# Altium project Sayma_RTM.PrjPcb (part 1 of 11)
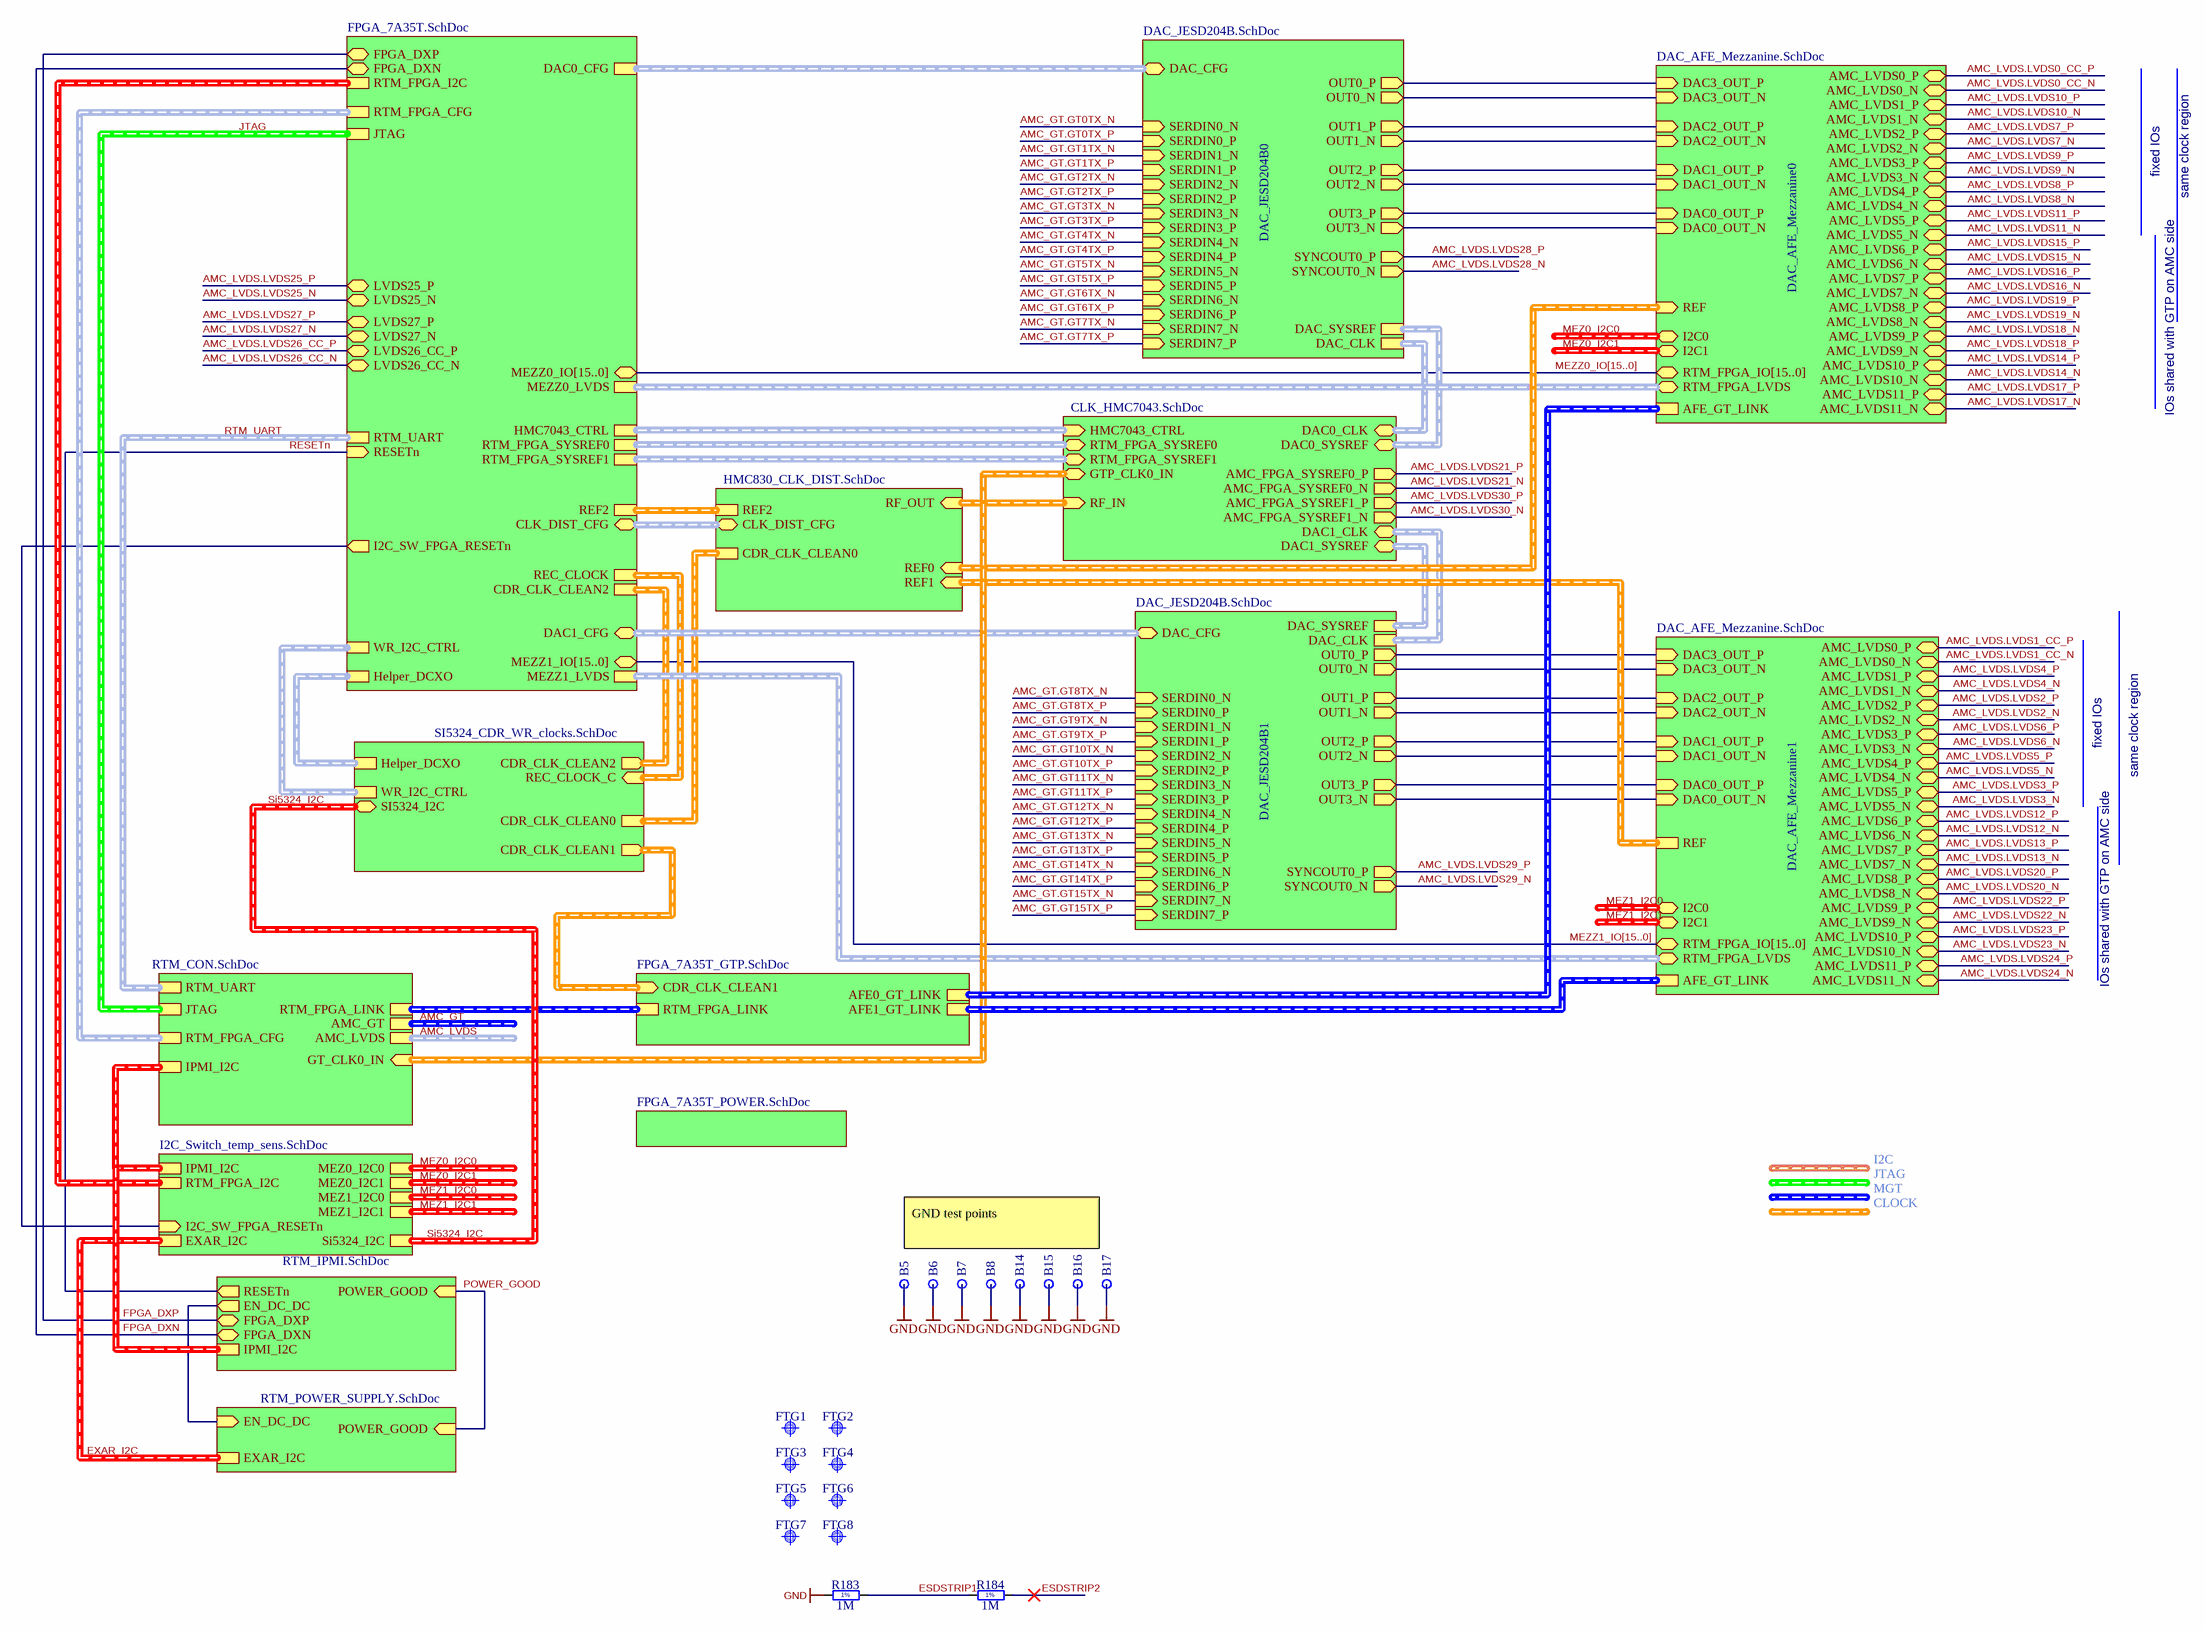
[diagram p0: Sayma_RTM.SchDoc]
18 sheets, 1194 parts. Net scope: hierarchical (ports join the sheet entries above them; power ports are global).
Board file: Sayma_RTM.PcbDoc
Sheets:
  Sayma_RTM.SchDoc
    FPGA_7A35T = FPGA_7A35T.SchDoc
    DAC_JESD204B1 = DAC_JESD204B.SchDoc
    DAC_JESD204B0 = DAC_JESD204B.SchDoc
    RTM_POWER_SUPPLY = RTM_POWER_SUPPLY.SchDoc
      PWR_SEPIC_N6V = PWR_SEPIC_N6V.SchDoc
      PWR_SEPIC_P12V_N12V = PWR_SEPIC_P12V_N12V.SchDoc
      PWR_Buck_2V_4V_4A = PWR_Buck_2V_4V_4A.SchDoc
      PWR_Buck_6V_8A = PWR_Buck_6V_8A.SchDoc
      PWR_buck_FPGA_EXAR = PWR_buck_FPGA_EXAR.SchDoc
    SI5324_CDR_WR_clocks = SI5324_CDR_WR_clocks.SchDoc
    HMC830_CLK_DIST = HMC830_CLK_DIST.SchDoc
    RTM_IPMI = RTM_IPMI.SchDoc
    DAC_AFE_Mezzanine0 = DAC_AFE_Mezzanine.SchDoc
    U_I2C_Switch_temp_sens = I2C_Switch_temp_sens.SchDoc
    U_RTM_CON = RTM_CON.SchDoc
    DAC_AFE_Mezzanine1 = DAC_AFE_Mezzanine.SchDoc
    U_CLK_HMC7043 = CLK_HMC7043.SchDoc
    U_FPGA_7A35T_GTP = FPGA_7A35T_GTP.SchDoc
    FPGA_7A35T_POWER = FPGA_7A35T_POWER.SchDoc

## Sheet Sayma_RTM.SchDoc: Sayma RTM
size 420 x 297 mm; $$Internal___BlkDate: 23:43:20_12-13-18; $$Internal_NAME_PLACEHOLDER: a2sheet_WUT; $$Internal_Resolution: 00001mm; $$NotCommonProperty_@NAME: Sayma_RTM; $$NotCommonProperty_@PRINTORDER: 1; $$NotCommonProperty_@SHEET: 1; $$NotCommonProperty_@SHEETTOTAL: 16; $$NotCommonProperty_FORWARD_PCB: 0; CmpIndex: 29; Drawing Author: G.Kasprowicz; Drawing Number: Sayma RTM; Drawing Project: 8 channel SAWG; Drawing Revision: 2.0; SymIndex: 2228; CheckedBy: P.K., M.S., T.P.,; Author: G.Kasprowicz; CompanyName: WUT ISE; DrawnBy: G.Kasprowicz; Organization: WUT ISE; Address1: PW ISE; Address2: Nowowiejska 15/19 00-665 Warsaw; Address3: gkasprow@gmail.com; DocumentNumber: 1; Revision: 1.0; SheetNumber: 1; SheetTotal: 18; ModifiedBy: -; CheckedDate: 01.2019; Title2: Top; DivGrp: WUT ISE; Designer: G.Kasprowicz; ModifiedDate: -; ProjectName: Sensor Box

### Parts
B5  Plated Hole  [c130h80]  (value not drawn)  (no BOM)
B6  Plated Hole  [c130h80]  (value not drawn)  (no BOM)
B7  Plated Hole  [c130h80]  (value not drawn)  (no BOM)
B8  Plated Hole  [c130h80]  (value not drawn)  (no BOM)
B14  Plated Hole  [c130h80]  (value not drawn)  (no BOM)
B15  Plated Hole  [c130h80]  (value not drawn)  (no BOM)
B16  Plated Hole  [c130h80]  (value not drawn)  (no BOM)
B17  Plated Hole  [c130h80]  (value not drawn)  (no BOM)
FTG1  Use only in PCB  [FIDUCIAL_TOP_C100-200]  (value not drawn)
FTG2  Use only in PCB  [FIDUCIAL_TOP_S100-200]  (value not drawn)
FTG3  Use only in PCB  [FIDUCIAL_TOP_C100-200]  (value not drawn)
FTG4  Use only in PCB  [FIDUCIAL_TOP_S100-200]  (value not drawn)
FTG5  Use only in PCB  [FIDUCIAL_TOP_C100-200]  (value not drawn)
FTG6  Use only in PCB  [FIDUCIAL_TOP_S100-200]  (value not drawn)
FTG7  Use only in PCB  [FIDUCIAL_TOP_C100-200]  (value not drawn)
FTG8  Use only in PCB  [FIDUCIAL_TOP_S100-200]  (value not drawn)
R183  1M  [RESC5025X65N]
R184  1M  [RESC5025X65N]

### Sub-sheets
DAC_AFE_Mezzanine0 = DAC_AFE_Mezzanine.SchDoc: REF (in), RTM_FPGA_IO[15..0] (bidir), RTM_FPGA_LVDS (bidir, harness MEZZ_LVDS), AMC_LVDS11_P (bidir), AMC_LVDS11_N (bidir), AMC_LVDS10_N (bidir), AMC_LVDS10_P (bidir), AMC_LVDS9_P (bidir), AMC_LVDS9_N (bidir), AMC_LVDS8_N (bidir), AMC_LVDS8_P (bidir), AMC_LVDS7_N (bidir), AMC_LVDS7_P (bidir), AMC_LVDS6_N (bidir), AMC_LVDS6_P (bidir), AMC_LVDS5_N (bidir), AMC_LVDS5_P (bidir), AMC_LVDS4_N (bidir), AMC_LVDS4_P (bidir), AMC_LVDS3_N (bidir), AMC_LVDS3_P (bidir), AMC_LVDS2_N (bidir), AMC_LVDS2_P (bidir), AMC_LVDS1_N (bidir), AMC_LVDS1_P (bidir), AMC_LVDS0_N (bidir), AMC_LVDS0_P (bidir), I2C1 (bidir, harness I2C), I2C0 (bidir, harness I2C), DAC3_OUT_P (in), DAC3_OUT_N (in), DAC2_OUT_N (in), DAC2_OUT_P (in), DAC1_OUT_N (in), DAC1_OUT_P (in), DAC0_OUT_N (in), DAC0_OUT_P (in), AFE_GT_LINK  | CmpIndex: 3; Name: MEZZ0; SymIndex: 1369
DAC_AFE_Mezzanine1 = DAC_AFE_Mezzanine.SchDoc: RTM_FPGA_IO[15..0] (bidir), RTM_FPGA_LVDS (bidir, harness MEZZ_LVDS), AMC_LVDS11_P (bidir), AMC_LVDS11_N (bidir), AMC_LVDS10_N (bidir), AMC_LVDS10_P (bidir), AMC_LVDS9_P (bidir), AMC_LVDS9_N (bidir), AMC_LVDS8_N (bidir), AMC_LVDS8_P (bidir), AMC_LVDS7_N (bidir), AMC_LVDS7_P (bidir), AMC_LVDS6_N (bidir), AMC_LVDS6_P (bidir), AMC_LVDS5_N (bidir), AMC_LVDS5_P (bidir), AMC_LVDS4_N (bidir), AMC_LVDS4_P (bidir), AMC_LVDS3_N (bidir), AMC_LVDS3_P (bidir), AMC_LVDS2_N (bidir), AMC_LVDS2_P (bidir), AMC_LVDS1_N (bidir), AMC_LVDS1_P (bidir), AMC_LVDS0_N (bidir), AMC_LVDS0_P (bidir), I2C1 (bidir, harness I2C), I2C0 (bidir, harness I2C), REF (harness CLKDIFF), DAC3_OUT_P (in), DAC3_OUT_N (in), DAC2_OUT_N (in), DAC2_OUT_P (in), DAC1_OUT_N (in), DAC1_OUT_P (in), DAC0_OUT_N (in), DAC0_OUT_P (in), AFE_GT_LINK  | CmpIndex: 3; Name: MEZZ0; SymIndex: 1369
DAC_JESD204B0 = DAC_JESD204B.SchDoc: SERDIN7_N (in), SERDIN2_P (in), SERDIN6_N (in), SERDIN3_P (in), SERDIN5_P (in), SERDIN4_P (in), SERDIN0_P (in), SERDIN1_P (in), SERDIN3_N (in), SERDIN1_N (in), SERDIN2_N (in), SERDIN4_N (in), SERDIN6_P (in), SERDIN5_N (in), SERDIN0_N (in), OUT3_N (out), OUT2_N (out), OUT0_N (out), OUT0_P (out), OUT3_P (out), OUT2_P (out), OUT1_N (out), OUT1_P (out), SERDIN7_P (in), DAC_CFG (bidir, harness DAC_CFG), SYNCOUT0_P (out), SYNCOUT0_N (out), DAC_CLK, DAC_SYSREF  | CmpIndex: 122; Name: DAC0; SymIndex: 1380
DAC_JESD204B1 = DAC_JESD204B.SchDoc: SERDIN7_N (in), SERDIN2_P (in), SERDIN6_N (in), SERDIN3_P (in), SERDIN5_P (in), SERDIN4_P (in), SERDIN0_P (in), SERDIN1_P (in), SERDIN3_N (in), SERDIN1_N (in), SERDIN2_N (in), SERDIN4_N (in), SERDIN6_P (in), SERDIN5_N (in), SERDIN0_N (in), OUT3_N (out), OUT2_N (out), OUT0_N (out), OUT0_P (out), OUT3_P (out), OUT2_P (out), OUT1_N (out), OUT1_P (out), SERDIN7_P (in), DAC_CFG (bidir, harness DAC_CFG), SYNCOUT0_P (out), SYNCOUT0_N (out), DAC_SYSREF, DAC_CLK (harness CLKDIFF)  | CmpIndex: 123; Name: DAC1; SymIndex: 1380
FPGA_7A35T = FPGA_7A35T.SchDoc: DAC1_CFG (bidir, harness DAC_CFG), CLK_DIST_CFG (bidir, harness CLK_DIST_CFG), FPGA_DXP (bidir), FPGA_DXN (bidir), RESETn (in), MEZZ0_IO[15..0] (bidir), MEZZ0_LVDS (harness MEZZ_LVDS), MEZZ1_IO[15..0] (bidir), MEZZ1_LVDS (harness MEZZ_LVDS), RTM_FPGA_I2C (harness I2C), RTM_UART (harness UART), JTAG (harness JTAG4), RTM_FPGA_CFG (harness RTM_FPGA_CFG), CDR_CLK_CLEAN2 (harness CLKDIFF), REC_CLOCK (harness CLKDIFF), DAC0_CFG (harness DAC_CFG), HMC7043_CTRL (harness HMC7043_CTRL), LVDS27_N (bidir), LVDS27_P (bidir), LVDS26_CC_N (bidir), LVDS26_CC_P (bidir), LVDS25_N (bidir), LVDS25_P (bidir), RTM_FPGA_SYSREF0 (harness CLKDIFF), RTM_FPGA_SYSREF1 (harness CLKDIFF), WR_I2C_CTRL (harness WR_I2C_CTRL), Helper_DCXO (harness CLKDIFF), I2C_SW_FPGA_RESETn (out), REF2  | CmpIndex: 127; Name: FPGA_7A35T; SymIndex: 1387
FPGA_7A35T_POWER = FPGA_7A35T_POWER.SchDoc: no entries  | CmpIndex: 52; Name: FPGA_7A35T_POWER; SymIndex: 1401
HMC830_CLK_DIST = HMC830_CLK_DIST.SchDoc: CLK_DIST_CFG (bidir, harness CLK_DIST_CFG), CDR_CLK_CLEAN0 (harness CLKDIFF), RF_OUT (in, harness CLKDIFF), REF0 (in, harness CLKDIFF), REF1 (in, harness CLKDIFF), REF2 (harness CLKDIFF)  | CmpIndex: 24; SymIndex: 1642
RTM_IPMI = RTM_IPMI.SchDoc: EN_DC_DC (out), FPGA_DXN (bidir), FPGA_DXP (bidir), RESETn (out), POWER_GOOD (in), IPMI_I2C  | CmpIndex: 15; Name: RTM_IPMI; SymIndex: 1389
RTM_POWER_SUPPLY = RTM_POWER_SUPPLY.SchDoc: POWER_GOOD (in), EN_DC_DC (in), EXAR_I2C  | CmpIndex: 98; Name: RTM_POWER_SUPPLY; SymIndex: 1474
SI5324_CDR_WR_clocks = SI5324_CDR_WR_clocks.SchDoc: SI5324_I2C (bidir, harness I2C), CDR_CLK_CLEAN2 (out, harness CLKDIFF), REC_CLOCK_C (in, harness CLKDIFF), CDR_CLK_CLEAN1 (out, harness CLKDIFF), CDR_CLK_CLEAN0 (harness CLKDIFF), WR_I2C_CTRL (harness WR_I2C_CTRL), Helper_DCXO (harness DIFF_CLK)  | CmpIndex: 54; Name: Si5324 Clock recovery; SymIndex: 1416
U_CLK_HMC7043 = CLK_HMC7043.SchDoc: DAC0_CLK (bidir, harness CLKDIFF), DAC1_SYSREF (bidir, harness CLKDIFF), DAC1_CLK (bidir, harness CLKDIFF), GTP_CLK0_IN (bidir, harness CLKDIFF), DAC0_SYSREF (bidir, harness CLKDIFF), RTM_FPGA_SYSREF0 (bidir, harness CLKDIFF), HMC7043_CTRL (in, harness HMC7043_CTRL), RF_IN (in, harness CLKDIFF), AMC_FPGA_SYSREF0_P (out), AMC_FPGA_SYSREF0_N (out), RTM_FPGA_SYSREF1 (bidir, harness CLKDIFF), AMC_FPGA_SYSREF1_P (out), AMC_FPGA_SYSREF1_N (out)
U_FPGA_7A35T_GTP = FPGA_7A35T_GTP.SchDoc: CDR_CLK_CLEAN1 (in, harness CLKDIFF), RTM_FPGA_LINK (harness GTx1_LINK), AFE0_GT_LINK (harness GTx1_LINK), AFE1_GT_LINK (harness GTx1_LINK)
U_I2C_Switch_temp_sens = I2C_Switch_temp_sens.SchDoc: IPMI_I2C (harness I2C), RTM_FPGA_I2C (harness I2C), MEZ0_I2C0 (harness I2C), MEZ0_I2C1 (harness I2C), MEZ1_I2C0 (harness I2C), MEZ1_I2C1 (harness I2C), Si5324_I2C (harness I2C), EXAR_I2C (harness I2C), I2C_SW_FPGA_RESETn (in)
U_RTM_CON = RTM_CON.SchDoc: RTM_FPGA_CFG (harness RTM_FPGA_CFG), AMC_GT (harness AMC_GT), AMC_LVDS (harness AMC_LVDS), IPMI_I2C (harness I2C), RTM_UART (harness UART), JTAG (harness JTAG4), RTM_FPGA_LINK (harness RTM_FPGA_CFG), GT_CLK0_IN (in, harness CLKDIFF)

### Nets
GND: B5.1 B6.1 B7.1 B8.1 B14.1 B15.1 B16.1 B17.1 R183.1
EN: sheet RTM_POWER_SUPPLY/EN_DC_DC, sheet RTM_IPMI/EN_DC_DC
ESDSTRIP1: R183.2 R184.1
ESDSTRIP2: R184.2
FPGA_DXN: sheet FPGA_7A35T/FPGA_DXN, sheet RTM_IPMI/FPGA_DXN
FPGA_DXP: sheet FPGA_7A35T/FPGA_DXP, sheet RTM_IPMI/FPGA_DXP
I2C_SW_FPGA_RESETn: sheet FPGA_7A35T/I2C_SW_FPGA_RESETn, sheet U_I2C_Switch_temp_sens/I2C_SW_FPGA_RESETn
OUT0_N: sheet DAC_JESD204B1/OUT0_N, sheet DAC_AFE_Mezzanine1/DAC3_OUT_N
OUT0_N: sheet DAC_JESD204B0/OUT0_N, sheet DAC_AFE_Mezzanine0/DAC3_OUT_N  [a separate net that carries the same name]
OUT0_P: sheet DAC_JESD204B1/OUT0_P, sheet DAC_AFE_Mezzanine1/DAC3_OUT_P
OUT0_P: sheet DAC_JESD204B0/OUT0_P, sheet DAC_AFE_Mezzanine0/DAC3_OUT_P  [a separate net that carries the same name]
OUT1_N: sheet DAC_JESD204B1/OUT1_N, sheet DAC_AFE_Mezzanine1/DAC2_OUT_N
OUT1_N: sheet DAC_JESD204B0/OUT1_N, sheet DAC_AFE_Mezzanine0/DAC2_OUT_N  [a separate net that carries the same name]
OUT1_P: sheet DAC_JESD204B1/OUT1_P, sheet DAC_AFE_Mezzanine1/DAC2_OUT_P
OUT1_P: sheet DAC_JESD204B0/OUT1_P, sheet DAC_AFE_Mezzanine0/DAC2_OUT_P  [a separate net that carries the same name]
OUT2_N: sheet DAC_JESD204B1/OUT2_N, sheet DAC_AFE_Mezzanine1/DAC1_OUT_N
OUT2_N: sheet DAC_JESD204B0/OUT2_N, sheet DAC_AFE_Mezzanine0/DAC1_OUT_N  [a separate net that carries the same name]
OUT2_P: sheet DAC_JESD204B1/OUT2_P, sheet DAC_AFE_Mezzanine1/DAC1_OUT_P
OUT2_P: sheet DAC_JESD204B0/OUT2_P, sheet DAC_AFE_Mezzanine0/DAC1_OUT_P  [a separate net that carries the same name]
OUT3_N: sheet DAC_JESD204B1/OUT3_N, sheet DAC_AFE_Mezzanine1/DAC0_OUT_N
OUT3_N: sheet DAC_JESD204B0/OUT3_N, sheet DAC_AFE_Mezzanine0/DAC0_OUT_N  [a separate net that carries the same name]
OUT3_P: sheet DAC_JESD204B1/OUT3_P, sheet DAC_AFE_Mezzanine1/DAC0_OUT_P
OUT3_P: sheet DAC_JESD204B0/OUT3_P, sheet DAC_AFE_Mezzanine0/DAC0_OUT_P  [a separate net that carries the same name]
POWER_GOOD: sheet RTM_POWER_SUPPLY/POWER_GOOD, sheet RTM_IPMI/POWER_GOOD  [project net PGOOD]
RESETn: sheet FPGA_7A35T/RESETn, sheet RTM_IPMI/RESETn

### Buses and harness runs
bus MEZZ0_IO[15..0] = sheet DAC_AFE_Mezzanine0/RTM_FPGA_IO[15..0] = sheet FPGA_7A35T/MEZZ0_IO[15..0]
bus MEZZ1_IO[15..0] = sheet DAC_AFE_Mezzanine1/RTM_FPGA_IO[15..0] = sheet FPGA_7A35T/MEZZ1_IO[15..0]
harness AMC_GT = sheet U_RTM_CON/AMC_GT
harness AMC_LVDS = sheet U_RTM_CON/AMC_LVDS
harness EXAR_I2C = sheet RTM_POWER_SUPPLY/EXAR_I2C = sheet U_I2C_Switch_temp_sens/EXAR_I2C
harness JTAG = sheet FPGA_7A35T/JTAG = sheet U_RTM_CON/JTAG
harness MEZ0_I2C0 = sheet DAC_AFE_Mezzanine0/I2C0
harness MEZ0_I2C0 = sheet U_I2C_Switch_temp_sens/MEZ0_I2C0
harness MEZ0_I2C1 = sheet DAC_AFE_Mezzanine0/I2C1
harness MEZ0_I2C1 = sheet U_I2C_Switch_temp_sens/MEZ0_I2C1
harness MEZ1_I2C0 = sheet DAC_AFE_Mezzanine1/I2C0
harness MEZ1_I2C0 = sheet U_I2C_Switch_temp_sens/MEZ1_I2C0
harness MEZ1_I2C1 = sheet DAC_AFE_Mezzanine1/I2C1
harness MEZ1_I2C1 = sheet U_I2C_Switch_temp_sens/MEZ1_I2C1
harness RTM_UART = sheet FPGA_7A35T/RTM_UART = sheet U_RTM_CON/RTM_UART
harness sheet DAC_AFE_Mezzanine0/AFE_GT_LINK = sheet U_FPGA_7A35T_GTP/AFE0_GT_LINK
harness sheet DAC_AFE_Mezzanine0/REF = sheet HMC830_CLK_DIST/REF0
harness sheet DAC_AFE_Mezzanine0/RTM_FPGA_LVDS = sheet FPGA_7A35T/MEZZ0_LVDS
harness sheet DAC_AFE_Mezzanine1/AFE_GT_LINK = sheet U_FPGA_7A35T_GTP/AFE1_GT_LINK
harness sheet DAC_AFE_Mezzanine1/REF = sheet HMC830_CLK_DIST/REF1
harness sheet DAC_AFE_Mezzanine1/RTM_FPGA_LVDS = sheet FPGA_7A35T/MEZZ1_LVDS
harness sheet DAC_JESD204B0/DAC_CFG = sheet FPGA_7A35T/DAC0_CFG
harness sheet DAC_JESD204B0/DAC_CLK = sheet U_CLK_HMC7043/DAC0_CLK
harness sheet DAC_JESD204B0/DAC_SYSREF = sheet U_CLK_HMC7043/DAC0_SYSREF
harness sheet DAC_JESD204B1/DAC_CFG = sheet FPGA_7A35T/DAC1_CFG
harness sheet DAC_JESD204B1/DAC_CLK = sheet U_CLK_HMC7043/DAC1_CLK
harness sheet DAC_JESD204B1/DAC_SYSREF = sheet U_CLK_HMC7043/DAC1_SYSREF
harness sheet FPGA_7A35T/CDR_CLK_CLEAN2 = sheet SI5324_CDR_WR_clocks/CDR_CLK_CLEAN2
harness sheet FPGA_7A35T/CLK_DIST_CFG = sheet HMC830_CLK_DIST/CLK_DIST_CFG
harness sheet FPGA_7A35T/Helper_DCXO = sheet SI5324_CDR_WR_clocks/Helper_DCXO
harness sheet FPGA_7A35T/HMC7043_CTRL = sheet U_CLK_HMC7043/HMC7043_CTRL
harness sheet FPGA_7A35T/REC_CLOCK = sheet SI5324_CDR_WR_clocks/REC_CLOCK_C
harness sheet FPGA_7A35T/REF2 = sheet HMC830_CLK_DIST/REF2
harness sheet FPGA_7A35T/RTM_FPGA_CFG = sheet U_RTM_CON/RTM_FPGA_CFG
harness sheet FPGA_7A35T/RTM_FPGA_I2C = sheet U_I2C_Switch_temp_sens/RTM_FPGA_I2C
harness sheet FPGA_7A35T/RTM_FPGA_SYSREF0 = sheet U_CLK_HMC7043/RTM_FPGA_SYSREF0
harness sheet FPGA_7A35T/RTM_FPGA_SYSREF1 = sheet U_CLK_HMC7043/RTM_FPGA_SYSREF1
harness sheet FPGA_7A35T/WR_I2C_CTRL = sheet SI5324_CDR_WR_clocks/WR_I2C_CTRL
harness sheet HMC830_CLK_DIST/CDR_CLK_CLEAN0 = sheet SI5324_CDR_WR_clocks/CDR_CLK_CLEAN0
harness sheet HMC830_CLK_DIST/RF_OUT = sheet U_CLK_HMC7043/RF_IN
harness sheet RTM_IPMI/IPMI_I2C = sheet U_I2C_Switch_temp_sens/IPMI_I2C = sheet U_RTM_CON/IPMI_I2C
harness sheet SI5324_CDR_WR_clocks/CDR_CLK_CLEAN1 = sheet U_FPGA_7A35T_GTP/CDR_CLK_CLEAN1
harness sheet U_CLK_HMC7043/GTP_CLK0_IN = sheet U_RTM_CON/GT_CLK0_IN
harness sheet U_FPGA_7A35T_GTP/RTM_FPGA_LINK = sheet U_RTM_CON/RTM_FPGA_LINK
harness Si5324_I2C = sheet SI5324_CDR_WR_clocks/SI5324_I2C = sheet U_I2C_Switch_temp_sens/Si5324_I2C

### Notes on the sheet
- fixed IOs
- same clock region
- IOs shared with GTP on AMC side
- I2C
- JTAG
- GND test points
- MGT
- CLOCK
- Project/Equipment
- Document
- Designer
- Drawn by
- Check.by
- Copyright WUT ISE 2018.
  This documentation describes Open Hardware and is licensed under the CERN OHL v.1.1. You may redistribute and modify this documentation under the terms of the CERN OHL v.1.1. (http://ohwr.org/CERNOHL). This documentation is distributed WITHOUT ANY EXPRESS OR IMPLIED WARRANTY, INCLUDING OF MERCHANTABILITY, SATISFACTORY QUALITY AND FITNESS FOR A PARTICULAR PURPOSE. Please see the CERN OHL v.1.1 for applicable conditions.
- Contact
- File
- Last Mod.
- Print Date
- Sheet
- Size
- A3
- of
- Rev
- (in symbol R2010_1M_1%_0.5W_200PPM) 1%

### Library data of the parts
B5-B8 B14-B17 = PLATED_HOLE0.8_PAD1.3: Single Terminal Socket; Part Description: Plated Through Hole: Hole Dia.=0.8mm Pad Dia.=1.3mm, IPC-7251 Level C; Mounted: No; Part Number: PLATED_HOLE0.8_PAD1.3; Component Type: Standard (No BOM); Pin Count: 1; Family: Plated Hole; Socket: No; SMD: No; Sense: No; Status: None; ComponentHeight: 0mm; HelpURL: Undefined; Author: CERN DEM JLC; CreateDate: 30.10.2008; LatestRevisionDate: 30.10.2008; PackageDescription: Plated Through Hole: Hole Dia.=0.8mm Pad Dia.=1.3mm, IPC-7251 Level C
FTG1 FTG3 FTG5 FTG7 = FIDUCIAL_TARGET_C100-200: Fiducial Target; Part Description: Round Fiducial Target, Top Layer, 1.0mm, Top Solder 2.0mm, Keepout =2.0mm; Mounted: No; Part Number: FIDUCIAL_TARGET_C100-200; Component Kind: Standard (No BOM); Component Type: Standard (No BOM); Pin Count: 1; Family: Fiducial; Socket: No; SMD: Yes; Sense: No; Status: None; ComponentHeight: 0mm; HelpURL: Undefined; Author: CERN DEM JLC; CreateDate: 09.02.2010; LatestRevisionDate: 04.04.2012; PackageDescription: Round Fiducial Target, Top Layer, 1.0mm, Top Solder 2.0mm, Keepout =2.0mm
FTG2 FTG4 FTG6 FTG8 = FIDUCIAL_TARGET_S100-200: Fiducial Target; Part Description: Square Fiducial Target, Top Layer, 1.0mm, Top Solder 2.0mm, Keepout =2.0mm; Mounted: No; Part Number: FIDUCIAL_TARGET_S100-200; Component Kind: Standard (No BOM); Component Type: Standard (No BOM); Pin Count: 1; Family: Fiducial; Socket: No; SMD: Yes; Sense: No; Status: None; ComponentHeight: 0mm; HelpURL: Undefined; Author: CERN DEM JLC; CreateDate: 09.02.2010; LatestRevisionDate: 04.04.2012; PackageDescription: Square Fiducial Target, Top Layer, 1.0mm, Top Solder 2.0mm, Keepout =2.0mm
R183 R184 = R2010_1M_1%_0.5W_200PPM: Resistor - 1%; Manufacturer: GENERIC; Manufacturer1 Part Number: LHVC2010-1MFT4; Part Description: Thick Film Chip Resistor; Power: 0.5W; TC: ±200ppm/°C; PressFit: No; Case: 2010; Manufacturer Part Number: R2010_1M_1%_0.5W_200PPM; Manufacturer1 ComponentHeight: 0.65mm; Manufacturer1 Example: TT WELWYN; Part Number: R2010_1M_1%_0.5W_200PPM; Pin Count: 2; Sense: No; SMD: Yes; Status: None; Tolerance: ±1%; Value: 1M; Component Kind: Standard; Component Type: Standard; Mounted: Yes; Socket: No; HelpURL: \\cern.ch\dfs\Applications\Altium\Datasheets\R2010_WELWYN_LHVC.pdf; Author: CERN DEM JLC; CreateDate: 26.02.2015; LatestRevisionDate: 26.02.2015